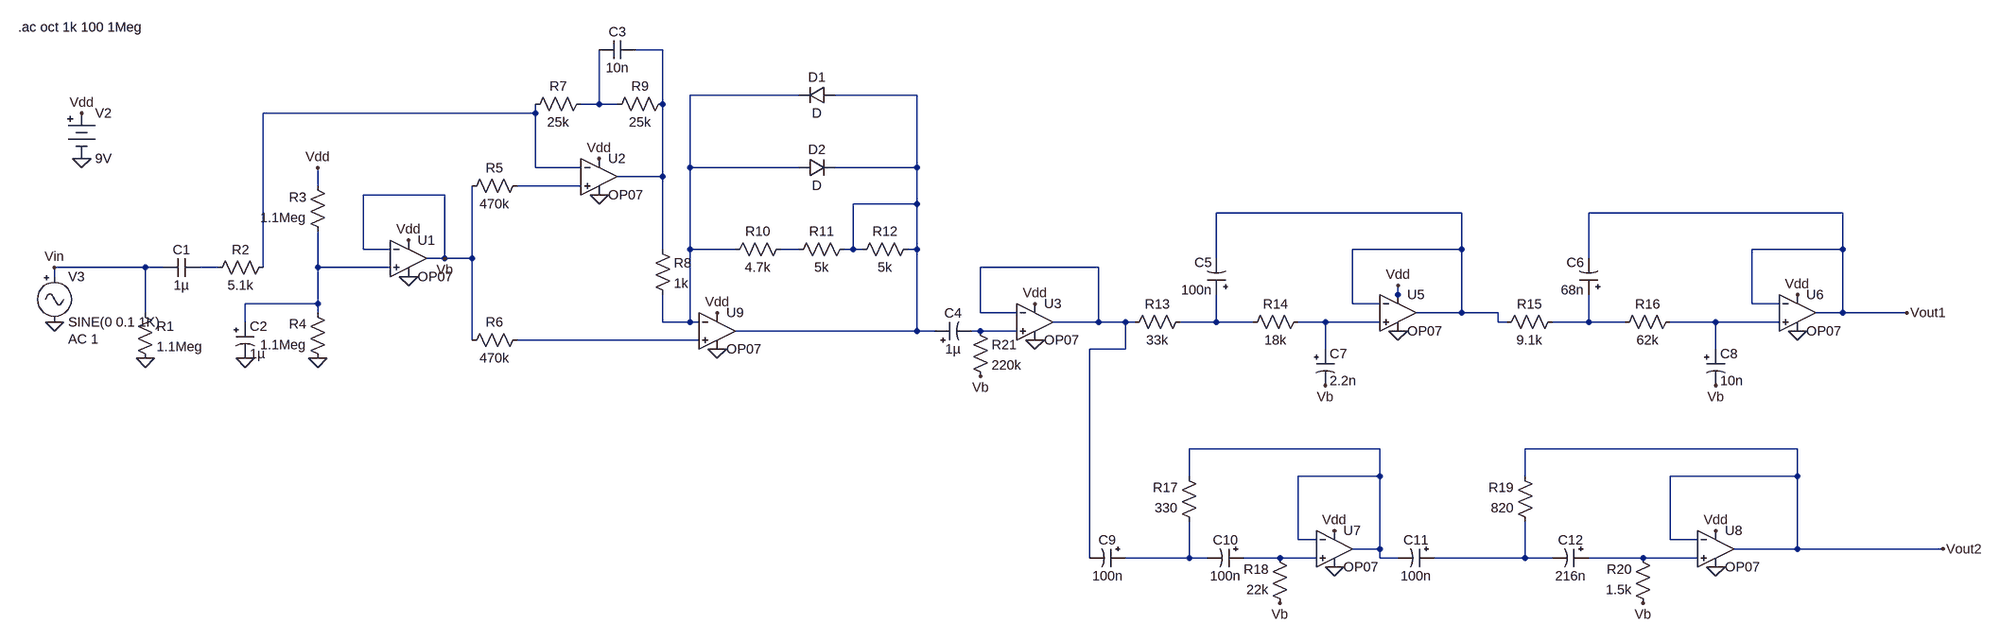
[diagram p0: schematic seniordesign.asc]
seniordesign.asc, the LTspice schematic file:
Version 4
SHEET 1 3376 788
WIRE 976 -256 928 -256
WIRE 1216 -176 1024 -176
WIRE 1424 -176 1280 -176
WIRE 864 -160 864 -256
WIRE 864 -160 832 -160
WIRE 896 -160 864 -160
WIRE 976 -160 976 -256
WIRE 752 -144 752 -160
WIRE 752 -144 272 -144
WIRE 752 -48 752 -144
WIRE 832 -48 752 -48
WIRE 1024 -48 1024 -176
WIRE 1216 -48 1024 -48
WIRE 1424 -48 1424 -176
WIRE 1424 -48 1280 -48
WIRE 976 -32 976 -160
WIRE 976 -32 896 -32
WIRE 368 -16 368 -48
WIRE 832 -16 720 -16
WIRE 592 0 448 0
WIRE 1424 16 1424 -48
WIRE 1424 16 1312 16
WIRE 2384 32 1952 32
WIRE 3056 32 2608 32
WIRE 448 96 448 0
WIRE 496 96 448 96
WIRE 976 96 976 -32
WIRE 1024 96 1024 -48
WIRE 1104 96 1024 96
WIRE 1216 96 1184 96
WIRE 1312 96 1312 16
WIRE 1312 96 1296 96
WIRE 1328 96 1312 96
WIRE 1424 96 1424 16
WIRE 1424 96 1408 96
WIRE 2384 96 2384 32
WIRE 2384 96 2192 96
WIRE 3056 96 3056 32
WIRE 3056 96 2896 96
WIRE 592 112 592 0
WIRE 592 112 560 112
WIRE 640 112 640 -16
WIRE 640 112 592 112
WIRE 1952 112 1952 32
WIRE 2608 112 2608 32
WIRE 64 128 -96 128
WIRE 96 128 64 128
WIRE 192 128 160 128
WIRE 272 128 272 -144
WIRE 368 128 368 64
WIRE 496 128 368 128
WIRE 1744 128 1536 128
WIRE -96 144 -96 128
WIRE 2272 176 2272 160
WIRE 368 192 368 128
WIRE 368 192 240 192
WIRE 2192 192 2192 96
WIRE 2240 192 2192 192
WIRE 2272 192 2272 176
WIRE 2896 192 2896 96
WIRE 2944 192 2896 192
WIRE 64 208 64 128
WIRE 368 208 368 192
WIRE 1536 208 1536 128
WIRE 1600 208 1536 208
WIRE 2384 208 2384 96
WIRE 2384 208 2304 208
WIRE 2448 208 2384 208
WIRE 3056 208 3056 96
WIRE 3056 208 3008 208
WIRE 3232 208 3056 208
WIRE 240 224 240 192
WIRE 976 224 976 176
WIRE 1024 224 1024 96
WIRE 1024 224 976 224
WIRE 1040 224 1024 224
WIRE 1744 224 1744 128
WIRE 1744 224 1664 224
WIRE 1792 224 1744 224
WIRE 1808 224 1792 224
WIRE 1952 224 1952 176
WIRE 1952 224 1888 224
WIRE 2016 224 1952 224
WIRE 2144 224 2096 224
WIRE 2240 224 2144 224
WIRE 2448 224 2448 208
WIRE 2464 224 2448 224
WIRE 2608 224 2608 176
WIRE 2608 224 2544 224
WIRE 2672 224 2608 224
WIRE 2832 224 2752 224
WIRE 2944 224 2832 224
WIRE 1424 240 1424 96
WIRE 1424 240 1104 240
WIRE 1456 240 1424 240
WIRE 1536 240 1520 240
WIRE 1600 240 1536 240
WIRE 640 256 640 112
WIRE 1040 256 720 256
WIRE 1792 272 1792 224
WIRE 1792 272 1728 272
WIRE 2144 272 2144 224
WIRE 2832 272 2832 224
WIRE 2240 448 1904 448
WIRE 2976 448 2496 448
WIRE 1904 496 1904 448
WIRE 2240 496 2240 448
WIRE 2240 496 2096 496
WIRE 2496 496 2496 448
WIRE 2976 496 2976 448
WIRE 2976 496 2752 496
WIRE 2096 608 2096 496
WIRE 2128 608 2096 608
WIRE 2752 608 2752 496
WIRE 2800 608 2752 608
WIRE 2240 624 2240 496
WIRE 2240 624 2192 624
WIRE 2976 624 2976 496
WIRE 2976 624 2864 624
WIRE 3296 624 2976 624
WIRE 1728 640 1728 272
WIRE 1904 640 1904 576
WIRE 1904 640 1792 640
WIRE 1936 640 1904 640
WIRE 2064 640 2000 640
WIRE 2128 640 2064 640
WIRE 2240 640 2240 624
WIRE 2272 640 2240 640
WIRE 2496 640 2496 576
WIRE 2496 640 2336 640
WIRE 2544 640 2496 640
WIRE 2704 640 2608 640
WIRE 2800 640 2704 640
FLAG 64 288 0
FLAG 240 288 0
FLAG 368 288 0
FLAG 864 0 0
FLAG 1072 272 0
FLAG 3296 624 Vout2
FLAG -96 128 Vin
FLAG -96 224 0
FLAG 2832 656 0
FLAG 2976 240 0
FLAG 2272 240 0
FLAG 2160 656 0
FLAG 1632 256 0
FLAG 528 144 0
FLAG 368 -48 Vdd
FLAG 528 80 Vdd
FLAG 864 -64 Vdd
FLAG -48 -144 Vdd
FLAG 1072 208 Vdd
FLAG 1632 192 Vdd
FLAG 2272 160 Vdd
FLAG 2976 176 Vdd
FLAG 2832 592 Vdd
FLAG 2160 592 Vdd
FLAG 2144 336 Vb
FLAG 2064 720 Vb
FLAG 2832 336 Vb
FLAG 2704 720 Vb
FLAG 3232 208 Vout1
FLAG -48 -64 0
FLAG 592 112 Vb
FLAG 1536 320 Vb
SYMBOL res 48 192 R0
SYMATTR InstName R1
SYMATTR Value 1.1Meg
SYMBOL res 288 112 R90
WINDOW 0 0 56 VBottom 2
WINDOW 3 32 56 VTop 2
SYMATTR InstName R2
SYMATTR Value 5.1k
SYMBOL res 384 80 R180
WINDOW 0 36 76 Left 2
WINDOW 3 36 40 Left 2
SYMATTR InstName R3
SYMATTR Value 1.1Meg
SYMBOL res 384 304 R180
WINDOW 0 36 76 Left 2
WINDOW 3 36 40 Left 2
SYMATTR InstName R4
SYMATTR Value 1.1Meg
SYMBOL cap 160 112 R90
WINDOW 0 0 32 VBottom 2
WINDOW 3 32 32 VTop 2
SYMATTR InstName C1
SYMATTR Value 1µ
SYMBOL res 736 -32 R90
WINDOW 0 0 56 VBottom 2
WINDOW 3 32 56 VTop 2
SYMATTR InstName R5
SYMATTR Value 470k
SYMBOL res 736 240 R90
WINDOW 0 0 56 VBottom 2
WINDOW 3 32 56 VTop 2
SYMATTR InstName R6
SYMATTR Value 470k
SYMBOL res 960 80 R0
SYMATTR InstName R8
SYMATTR Value 1k
SYMBOL polcap 224 224 R0
SYMATTR InstName C2
SYMATTR Value 1µ
SYMBOL res 848 -176 R90
WINDOW 0 0 56 VBottom 2
WINDOW 3 32 56 VTop 2
SYMATTR InstName R7
SYMATTR Value 25k
SYMBOL res 992 -176 R90
WINDOW 0 0 56 VBottom 2
WINDOW 3 32 56 VTop 2
SYMATTR InstName R9
SYMATTR Value 25k
SYMBOL cap 928 -272 R90
WINDOW 0 0 32 VBottom 2
WINDOW 3 32 32 VTop 2
SYMATTR InstName C3
SYMATTR Value 10n
SYMBOL res 1200 80 R90
WINDOW 0 0 56 VBottom 2
WINDOW 3 32 56 VTop 2
SYMATTR InstName R10
SYMATTR Value 4.7k
SYMBOL res 1312 80 R90
WINDOW 0 0 56 VBottom 2
WINDOW 3 32 56 VTop 2
SYMATTR InstName R11
SYMATTR Value 5k
SYMBOL res 1424 80 R90
WINDOW 0 0 56 VBottom 2
WINDOW 3 32 56 VTop 2
SYMATTR InstName R12
SYMATTR Value 5k
SYMBOL diode 1280 -192 R90
WINDOW 0 0 32 VBottom 2
WINDOW 3 32 32 VTop 2
SYMATTR InstName D1
SYMBOL diode 1216 -32 R270
WINDOW 0 32 32 VTop 2
WINDOW 3 0 32 VBottom 2
SYMATTR InstName D2
SYMBOL polcap 1456 256 R270
WINDOW 0 32 32 VTop 2
WINDOW 3 0 32 VBottom 2
SYMATTR InstName C4
SYMATTR Value 1µ
SYMBOL res 1904 208 R90
WINDOW 0 0 56 VBottom 2
WINDOW 3 32 56 VTop 2
SYMATTR InstName R13
SYMATTR Value 33k
SYMBOL res 2112 208 R90
WINDOW 0 0 56 VBottom 2
WINDOW 3 32 56 VTop 2
SYMATTR InstName R14
SYMATTR Value 18k
SYMBOL res 2560 208 R90
WINDOW 0 0 56 VBottom 2
WINDOW 3 32 56 VTop 2
SYMATTR InstName R15
SYMATTR Value 9.1k
SYMBOL res 2768 208 R90
WINDOW 0 0 56 VBottom 2
WINDOW 3 32 56 VTop 2
SYMATTR InstName R16
SYMATTR Value 62k
SYMBOL res 1920 592 R180
WINDOW 0 36 76 Left 2
WINDOW 3 36 40 Left 2
SYMATTR InstName R17
SYMATTR Value 330
SYMBOL res 2080 736 R180
WINDOW 0 36 76 Left 2
WINDOW 3 36 40 Left 2
SYMATTR InstName R18
SYMATTR Value 22k
SYMBOL res 2512 592 R180
WINDOW 0 36 76 Left 2
WINDOW 3 36 40 Left 2
SYMATTR InstName R19
SYMATTR Value 820
SYMBOL res 2720 736 R180
WINDOW 0 36 76 Left 2
WINDOW 3 36 40 Left 2
SYMATTR InstName R20
SYMATTR Value 1.5k
SYMBOL polcap 1968 176 R180
WINDOW 0 24 57 Left 2
WINDOW 3 24 8 Left 2
SYMATTR InstName C5
SYMATTR Value 100n
SYMBOL polcap 2624 176 R180
WINDOW 0 24 57 Left 2
WINDOW 3 24 8 Left 2
SYMATTR InstName C6
SYMATTR Value 68n
SYMBOL polcap 2128 272 R0
SYMATTR InstName C7
SYMATTR Value 2.2n
SYMBOL polcap 2816 272 R0
SYMATTR InstName C8
SYMATTR Value 10n
SYMBOL polcap 2336 624 R90
WINDOW 0 0 32 VBottom 2
WINDOW 3 32 32 VTop 2
SYMATTR InstName C11
SYMATTR Value 100n
SYMBOL polcap 2608 624 R90
WINDOW 0 0 32 VBottom 2
WINDOW 3 32 32 VTop 2
SYMATTR InstName C12
SYMATTR Value 216n
SYMBOL polcap 1792 624 R90
WINDOW 0 0 32 VBottom 2
WINDOW 3 32 32 VTop 2
SYMATTR InstName C9
SYMATTR Value 100n
SYMBOL polcap 2000 624 R90
WINDOW 0 0 32 VBottom 2
WINDOW 3 32 32 VTop 2
SYMATTR InstName C10
SYMATTR Value 100n
SYMBOL Opamps/OP07 2272 144 R0
SYMATTR InstName U5
SYMBOL Opamps/OP07 2976 144 R0
SYMATTR InstName U6
SYMBOL Opamps/OP07 2160 560 R0
SYMATTR InstName U7
SYMBOL Opamps/OP07 2832 560 R0
SYMATTR InstName U8
SYMBOL Misc/battery -48 -160 R0
SYMATTR InstName V2
SYMATTR Value 9V
SYMBOL Misc/signal -96 128 R0
WINDOW 123 24 126 Left 2
SYMATTR Value2 AC 1
SYMATTR InstName V3
SYMATTR Value SINE(0 0.1 1K)
SYMBOL Opamps/OP07 1072 176 R0
SYMATTR InstName U9
SYMBOL Opamps/OP07 528 48 R0
SYMATTR InstName U1
SYMBOL Opamps/OP07 864 -96 R0
SYMATTR InstName U2
SYMBOL Opamps/OP07 1632 160 R0
SYMATTR InstName U3
SYMBOL res 1520 224 R0
SYMATTR InstName R21
SYMATTR Value 220k
TEXT -160 -296 Left 2 !.ac oct 1k 100 1Meg

The netlist it stands for:
* seniordesign.asc
R1 Vin 0 1.1Meg
R2 N005 N009 5.1k
R3 N010 Vdd 1.1Meg
R4 0 N010 1.1Meg
C1 N009 Vin 1µ
R5 N006 Vb 470k
R6 N017 Vb 470k
R8 N001 N002 1k
C2 N010 0 1µ
R7 N004 N005 25k
R9 N001 N004 25k
C3 N001 N004 10n
R10 N008 N002 4.7k
R11 N003 N008 5k
R12 N003 N003 5k
D1 N003 N002 D
D2 N002 N003 D
C4 N003 N016 1µ
R13 N012 N011 33k
R14 N013 N012 18k
R15 N014 N007 9.1k
R16 N015 N014 62k
R17 N019 N018 330
R18 Vb N020 22k
R19 N021 Vout2 820
R20 Vb N022 1.5k
C5 N012 N007 100n
C6 N014 Vout1 68n
C7 N013 Vb 2.2n
C8 N015 Vb 10n
C11 N021 N018 100n
C12 N022 N021 216n
C9 N019 N011 100n
C10 N020 N019 100n
XU5 N013 N007 Vdd 0 N007 LT1001  ; OP07, pins In+ In- V+ V- OUT
XU6 N015 Vout1 Vdd 0 Vout1 LT1001  ; OP07, pins In+ In- V+ V- OUT
XU7 N020 N018 Vdd 0 N018 LT1001  ; OP07, pins In+ In- V+ V- OUT
XU8 N022 Vout2 Vdd 0 Vout2 LT1001  ; OP07, pins In+ In- V+ V- OUT
V2 Vdd 0 9V
V3 Vin 0 SINE(0 0.1 1K) AC 1
XU9 N017 N002 Vdd 0 N003 LT1001  ; OP07, pins In+ In- V+ V- OUT
XU1 N010 Vb Vdd 0 Vb LT1001  ; OP07, pins In+ In- V+ V- OUT
XU2 N006 N005 Vdd 0 N001 LT1001  ; OP07, pins In+ In- V+ V- OUT
XU3 N016 N011 Vdd 0 N011 LT1001  ; OP07, pins In+ In- V+ V- OUT
R21 N016 Vb 220k
.model D D
.lib standard.dio
.ac oct 1k 100 1Meg
.lib LTC.lib
.backanno
.end